# EAGLE schematic MainBoard (EAGLE 7.2.0)
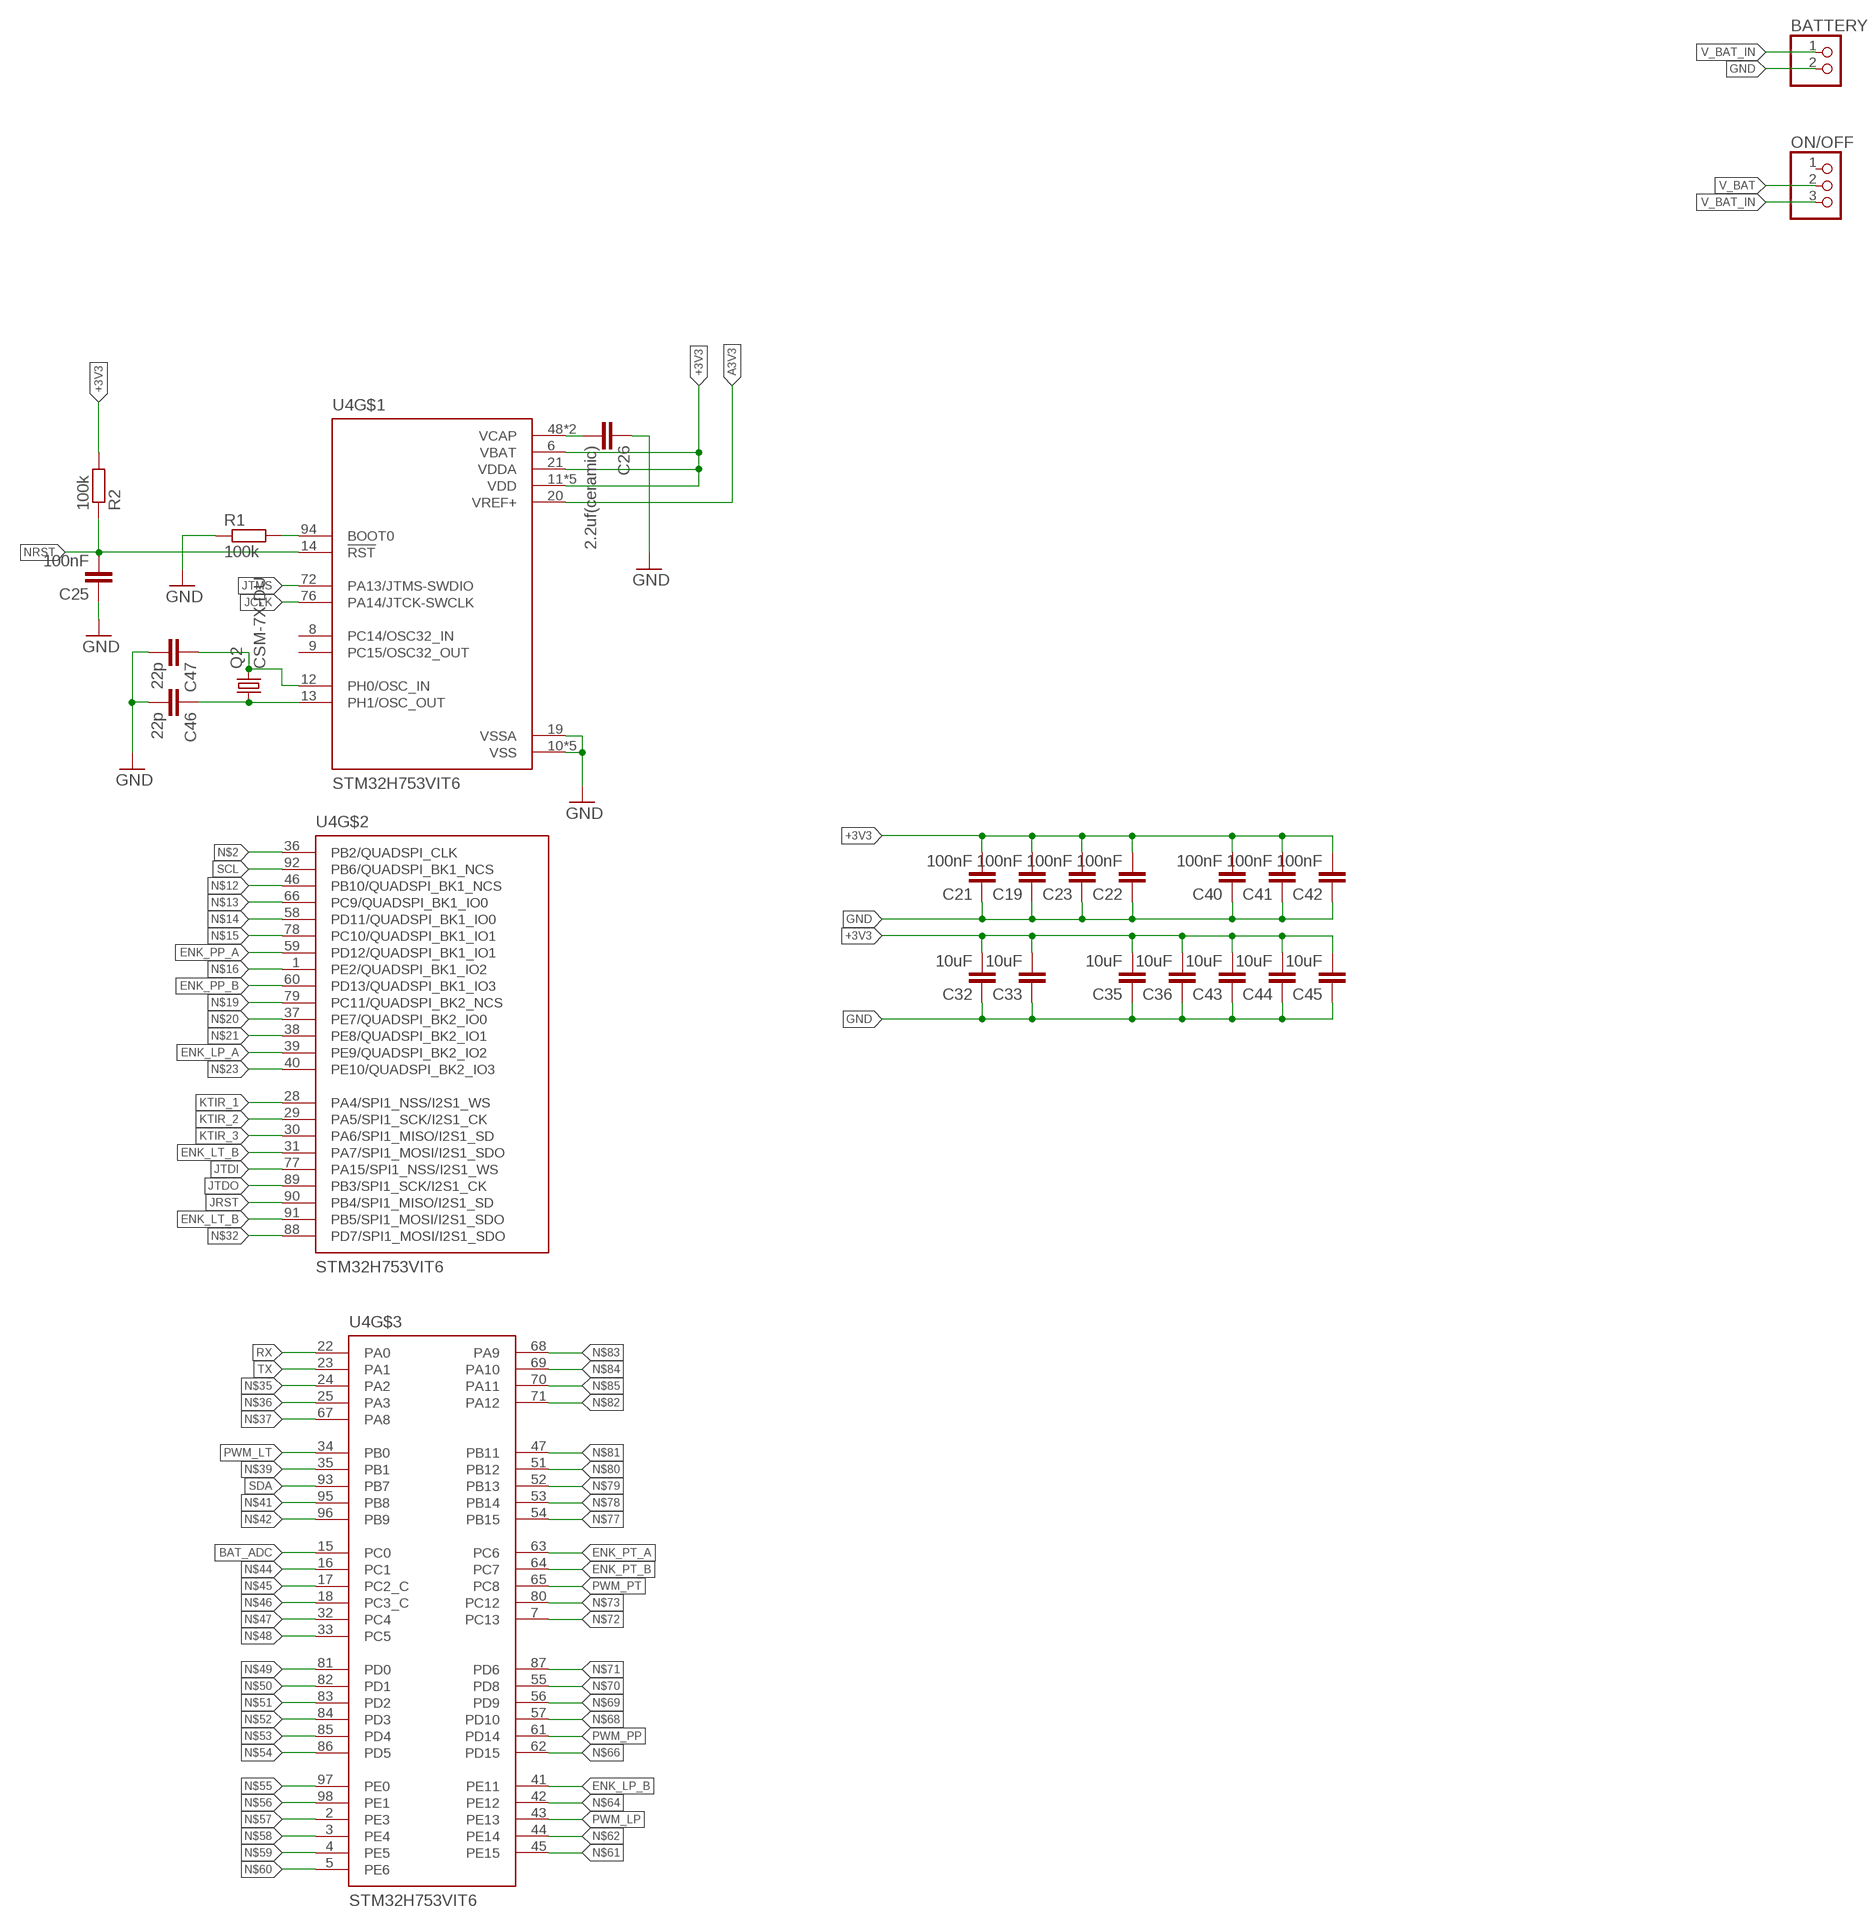
[diagram p0: schematic, sheet 1, part 1 of 2]
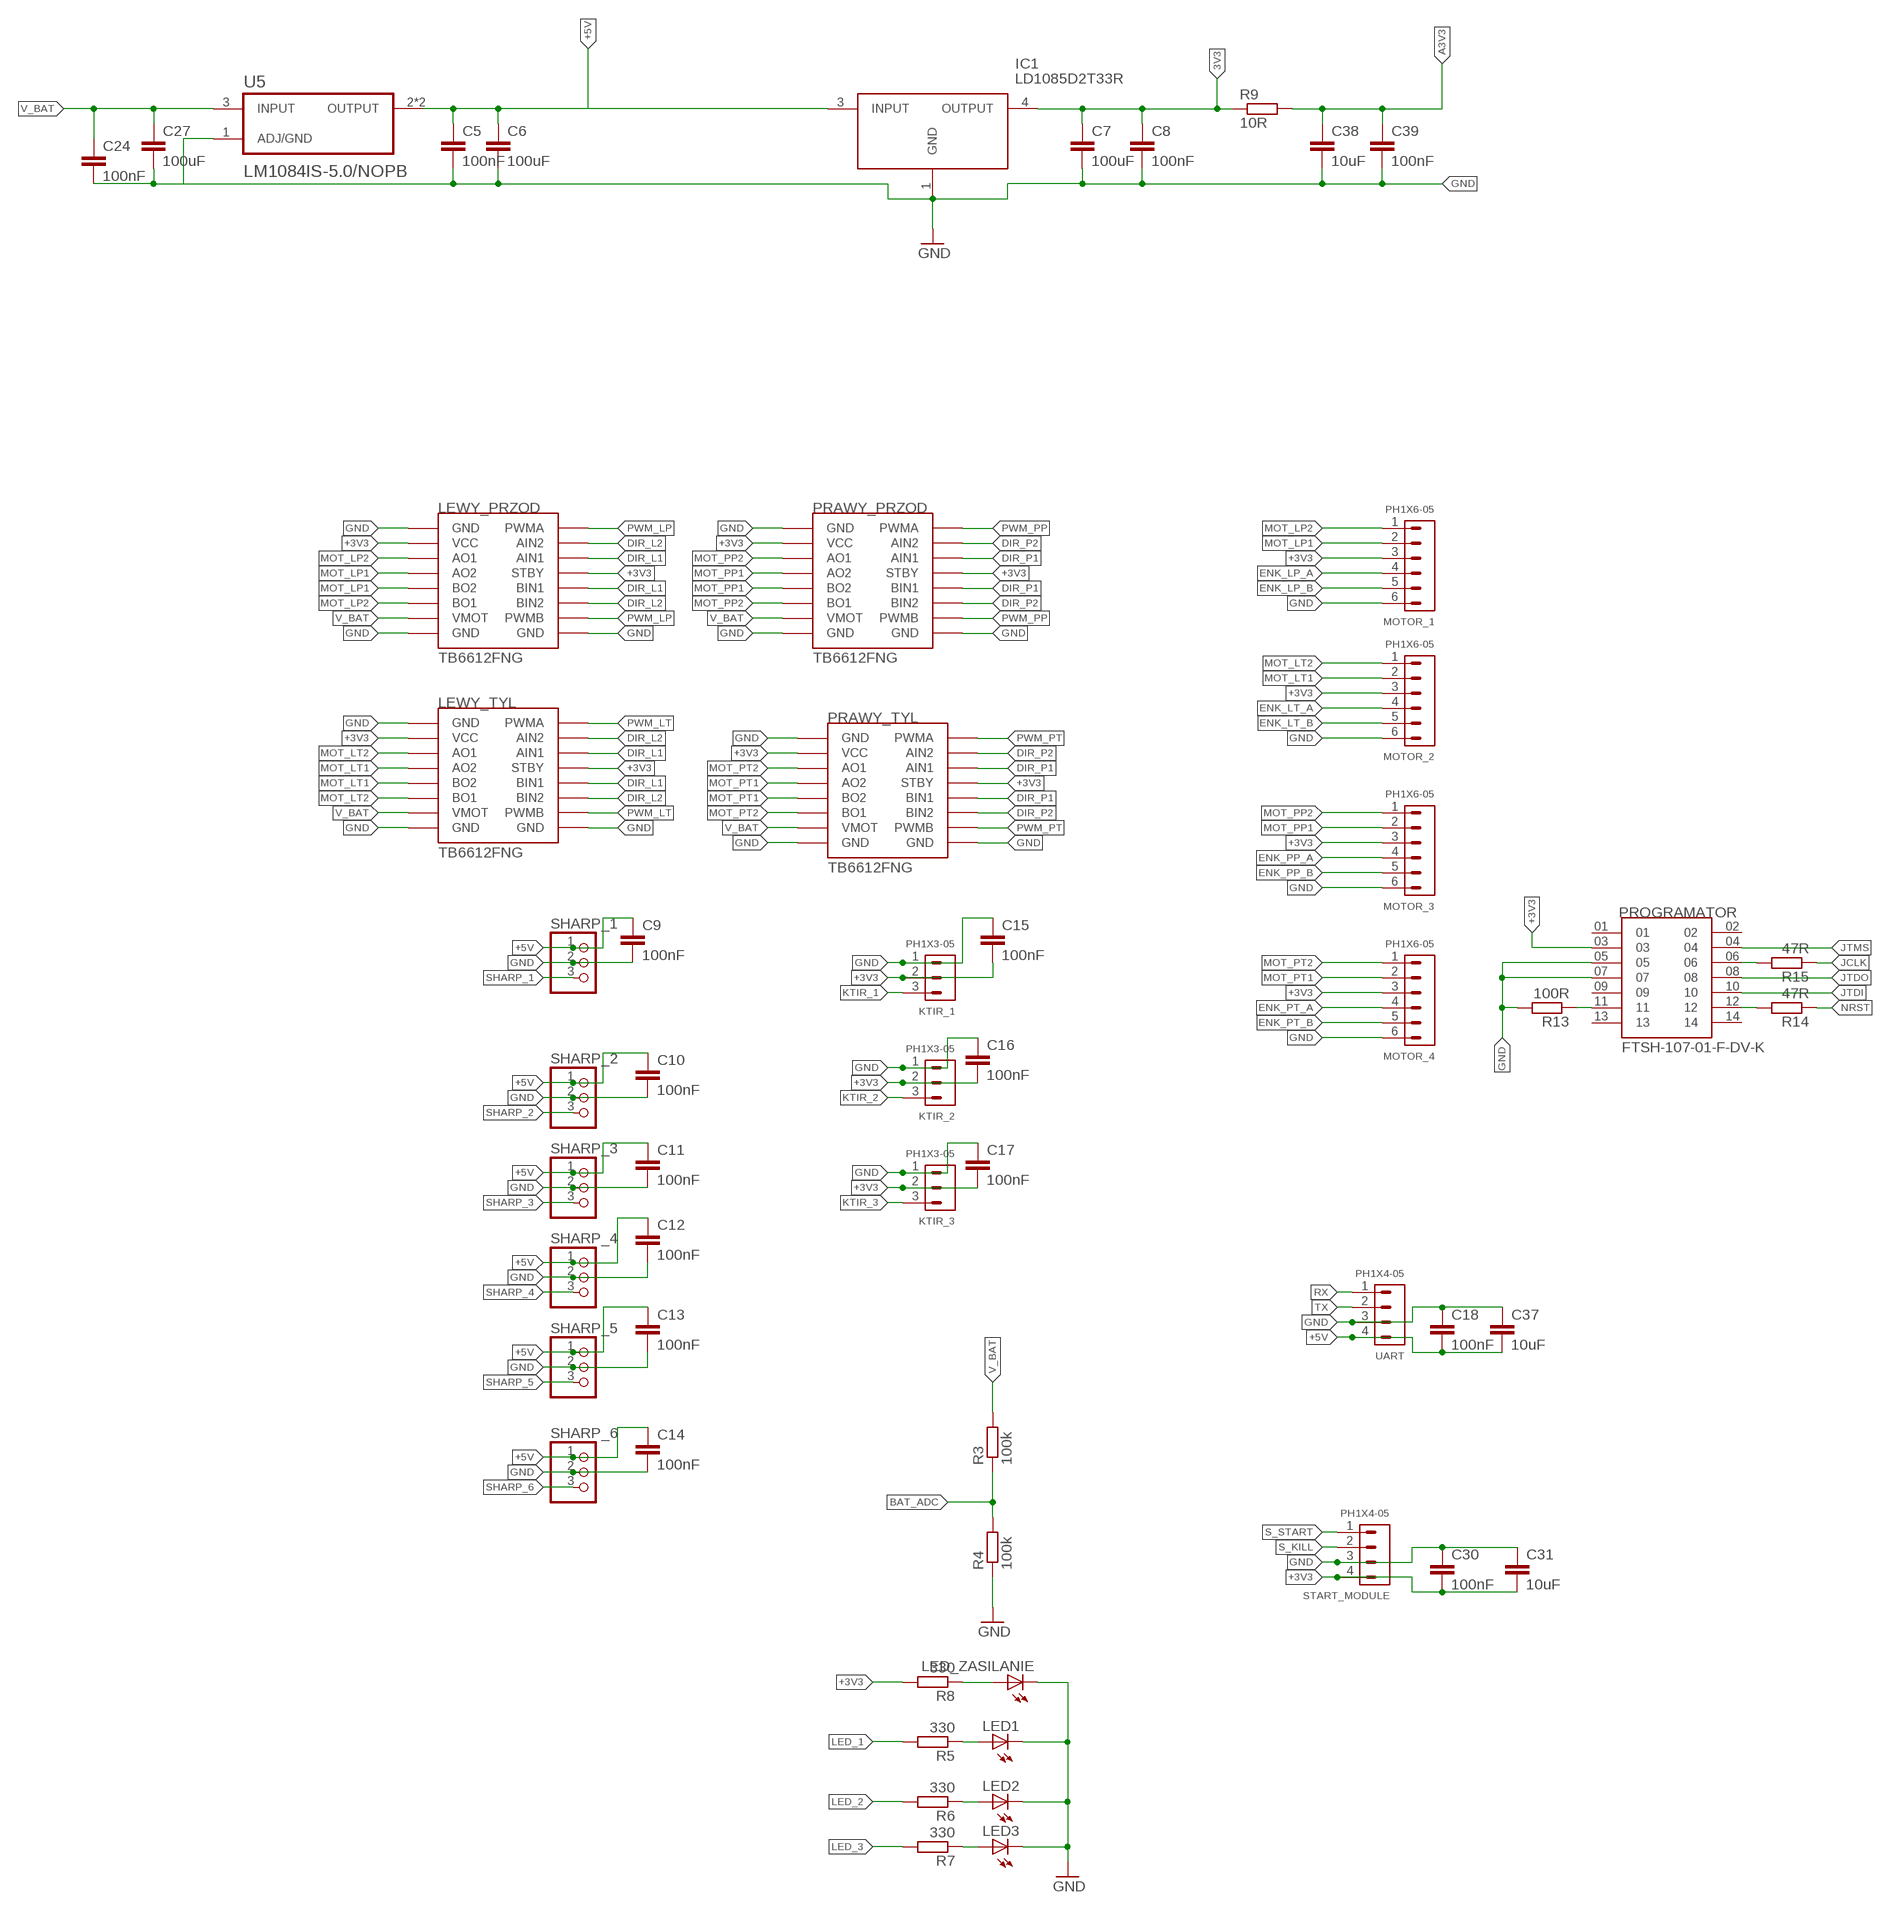
[diagram p1: schematic, sheet 1, part 2 of 2]

## Parts
BATTERY  PINHD-1X2  [1X02]
C5  100nF  C-EUC0805  [C0805]
C6  100uF  C-EUC0805  [C0805]
C7  100uF  C-EUC0805  [C0805]
C8  100nF  C-EUC0805  [C0805]
C9  100nF  C-EUC0805  [C0805]
C10  100nF  C-EUC0805  [C0805]
C11  100nF  C-EUC0805  [C0805]
C12  100nF  C-EUC0805  [C0805]
C13  100nF  C-EUC0805  [C0805]
C14  100nF  C-EUC0805  [C0805]
C15  100nF  C-EUC0805  [C0805]
C16  100nF  C-EUC0805  [C0805]
C17  100nF  C-EUC0805  [C0805]
C18  100nF  C-EUC0805  [C0805]
C19  100nF  C-EUC0805  [C0805]
C21  100nF  C-EUC0805  [C0805]
C22  100nF  C-EUC0805  [C0805]
C23  100nF  C-EUC0805  [C0805]
C24  100nF  C-EUC0805  [C0805]
C25  100nF  C-EUC0805  [C0805]
C26  2.2uf(ceramic)  C-EUC0805  [C0805]
C27  100uF  C-EUC0805  [C0805]
C30  100nF  C-EUC0805  [C0805]
C31  10uF  C-EUC0805  [C0805]
C32  10uF  C-EUC0805  [C0805]
C33  10uF  C-EUC0805  [C0805]
C35  10uF  C-EUC0805  [C0805]
C36  10uF  C-EUC0805  [C0805]
C37  10uF  C-EUC0805  [C0805]
C38  10uF  C-EUC0805  [C0805]
C39  100nF  C-EUC0805  [C0805]
C40  100nF  C-EUC0805  [C0805]
C41  100nF  C-EUC0805  [C0805]
C42  100nF  C-EUC0805  [C0805]
C43  10uF  C-EUC0805  [C0805]
C44  10uF  C-EUC0805  [C0805]
C45  10uF  C-EUC0805  [C0805]
C46  22p  C-EUC0805  [C0805]
C47  22p  C-EUC0805  [C0805]
IC1  LD1085D2T33R  [LD1085D2T33R]
KTIR_1  PH1X3-05  [PH005-1-3]
KTIR_2  PH1X3-05  [PH005-1-3]
KTIR_3  PH1X3-05  [PH005-1-3]
LED1  LEDCHIPLED_0805  [CHIPLED_0805]
LED2  LEDCHIPLED_0805  [CHIPLED_0805]
LED3  LEDCHIPLED_0805  [CHIPLED_0805]
LED_ZASILANIE  LEDCHIPLED_0805  [CHIPLED_0805]
LEWY_PRZOD  MODUL_POLOLU  [MODUL_POLOLU]
LEWY_TYL  MODUL_POLOLU  [MODUL_POLOLU]
MOTOR_1  PH1X6-05  [PH005-1-6]
MOTOR_2  PH1X6-05  [PH005-1-6]
MOTOR_3  PH1X6-05  [PH005-1-6]
MOTOR_4  PH1X6-05  [PH005-1-6]
ON/OFF  PINHD-1X3  [1X03]
PRAWY_PRZOD  MODUL_POLOLU  [MODUL_POLOLU]
PRAWY_TYL  MODUL_POLOLU  [MODUL_POLOLU]
PROGRAMATOR  FTSH-107-01-F-DV-K  [SAMTEC_FTSH-107-01-F-DV-K]
Q2  CSM-7X-DU  [CSM-7X-DU]
R1  100k  R-EU_M0805  [M0805]
R2  100k  R-EU_M0805  [M0805]
R3  100k  R-EU_M0805  [M0805]
R4  100k  R-EU_M0805  [M0805]
R5  330  R-EU_M0805  [M0805]
R6  330  R-EU_M0805  [M0805]
R7  330  R-EU_M0805  [M0805]
R8  330  R-EU_M0805  [M0805]
R9  10R  R-EU_M0805  [M0805]
R13  100R  R-EU_M0805  [M0805]
R14  47R  R-EU_M0805  [M0805]
R15  47R  R-EU_M0805  [M0805]
SHARP_1  PINHD-1X3  [1X03]
SHARP_2  PINHD-1X3  [1X03]
SHARP_3  PINHD-1X3  [1X03]
SHARP_4  PINHD-1X3  [1X03]
SHARP_5  PINHD-1X3  [1X03]
SHARP_6  PINHD-1X3  [1X03]
START_MODULE  PH1X4-05  [PH005-1-4]
U4  STM32H753VIT6  [QFP50P1600X1600X160-100N]
U5  LM1084IS-5.0/NOPB  [TO254P1524X483-4N]
UART  PH1X4-05  [PH005-1-4]

## Nets
3V3: C7.1 C8.1 IC1.4(OUTPUT) R9.1
+3V3: C15.2 C16.2 C17.2 C19.2 C21.2 C22.2 C23.2 C30.2 C31.2 C32.2 C33.2 C35.2 C36.2 C40.2 C41.2 C42.2 C43.2 C44.2 C45.2 KTIR_1.2 KTIR_2.2 KTIR_3.2 LEWY_PRZOD.STBY LEWY_PRZOD.VCC LEWY_TYL.STBY LEWY_TYL.VCC MOTOR_1.3 MOTOR_2.3 MOTOR_3.3 MOTOR_4.3 PRAWY_PRZOD.STBY PRAWY_PRZOD.VCC PRAWY_TYL.STBY PRAWY_TYL.VCC PROGRAMATOR.03 R2.2 R8.2 START_MODULE.4 U4.6(VBAT) U4.11(VDD) U4.21(VDDA) U4.27(VDD) U4.50(VDD) U4.75(VDD) U4.100(VDD)
+5V: C5.1 C6.1 C9.1 C10.1 C11.1 C12.1 C13.1 C14.1 C18.2 C37.2 IC1.3(INPUT) SHARP_1.1 SHARP_2.1 SHARP_3.1 SHARP_4.1 SHARP_5.1 SHARP_6.1 U5.2(OUTPUT) U5.4(OUTPUT) UART.4
A3V3: C38.1 C39.1 R9.2 U4.20(VREF+)
BAT_ADC: R3.1 R4.2 U4.15(PC0)
DIR_L1: LEWY_PRZOD.AIN1 LEWY_PRZOD.BIN1 LEWY_TYL.AIN1 LEWY_TYL.BIN1
DIR_L2: LEWY_PRZOD.AIN2 LEWY_PRZOD.BIN2 LEWY_TYL.AIN2 LEWY_TYL.BIN2
DIR_P1: PRAWY_PRZOD.AIN1 PRAWY_PRZOD.BIN1 PRAWY_TYL.AIN1 PRAWY_TYL.BIN1
DIR_P2: PRAWY_PRZOD.AIN2 PRAWY_PRZOD.BIN2 PRAWY_TYL.AIN2 PRAWY_TYL.BIN2
ENK_LP_A: MOTOR_1.4 U4.39(PE9/QUADSPI_BK2_IO2)
ENK_LP_B: MOTOR_1.5 U4.41(PE11)
ENK_LT_A: MOTOR_2.4
ENK_LT_B: MOTOR_2.5 U4.31(PA7/SPI1_MOSI/I2S1_SDO) U4.91(PB5/SPI1_MOSI/I2S1_SDO)
ENK_PP_A: MOTOR_3.4 U4.59(PD12/QUADSPI_BK1_IO1)
ENK_PP_B: MOTOR_3.5 U4.60(PD13/QUADSPI_BK1_IO3)
ENK_PT_A: MOTOR_4.4 U4.63(PC6)
ENK_PT_B: MOTOR_4.5 U4.64(PC7)
GND: BATTERY.2 C5.2 C6.2 C7.2 C8.2 C9.2 C10.2 C11.2 C12.2 C13.2 C14.2 C15.1 C16.1 C17.1 C18.1 C19.1 C21.1 C22.1 C23.1 C25.1 C26.1 C30.1 C31.1 C32.1 C33.1 C35.1 C36.1 C37.1 C38.2 C39.2 C40.1 C41.1 C42.1 C43.1 C44.1 C45.1 C46.2 C47.2 IC1.1(GND) KTIR_1.1 KTIR_2.1 KTIR_3.1 LED1.C LED2.C LED3.C LED_ZASILANIE.C LEWY_PRZOD.GND1(GND) LEWY_PRZOD.GND2(GND) LEWY_PRZOD.GND3(GND) LEWY_TYL.GND1(GND) LEWY_TYL.GND2(GND) LEWY_TYL.GND3(GND) MOTOR_1.6 MOTOR_2.6 MOTOR_3.6 MOTOR_4.6 PRAWY_PRZOD.GND1(GND) PRAWY_PRZOD.GND2(GND) PRAWY_PRZOD.GND3(GND) PRAWY_TYL.GND1(GND) PRAWY_TYL.GND2(GND) PRAWY_TYL.GND3(GND) PROGRAMATOR.05 PROGRAMATOR.07 R1.1 R4.1 R13.2 SHARP_1.2 SHARP_2.2 SHARP_3.2 SHARP_4.2 SHARP_5.2 SHARP_6.2 START_MODULE.3 U4.10(VSS) U4.19(VSSA) U4.26(VSS) U4.49(VSS) U4.74(VSS) U4.99(VSS) UART.3
JCLK: R15.1 U4.76(PA14/JTCK-SWCLK)
JRST: U4.90(PB4/SPI1_MISO/I2S1_SD)
JTDI: PROGRAMATOR.10 U4.77(PA15/SPI1_NSS/I2S1_WS)
JTDO: PROGRAMATOR.08 U4.89(PB3/SPI1_SCK/I2S1_CK)
JTMS: PROGRAMATOR.04 U4.72(PA13/JTMS-SWDIO)
KTIR_1: KTIR_1.3 U4.28(PA4/SPI1_NSS/I2S1_WS)
KTIR_2: KTIR_2.3 U4.29(PA5/SPI1_SCK/I2S1_CK)
KTIR_3: KTIR_3.3 U4.30(PA6/SPI1_MISO/I2S1_SD)
LED_1: R5.2
LED_2: R6.2
LED_3: R7.2
MOT_LP1: LEWY_PRZOD.A02(AO2) LEWY_PRZOD.BO2 MOTOR_1.2
MOT_LP2: LEWY_PRZOD.AO1 LEWY_PRZOD.BO1 MOTOR_1.1
MOT_LT1: LEWY_TYL.A02(AO2) LEWY_TYL.BO2 MOTOR_2.2
MOT_LT2: LEWY_TYL.AO1 LEWY_TYL.BO1 MOTOR_2.1
MOT_PP1: MOTOR_3.2 PRAWY_PRZOD.A02(AO2) PRAWY_PRZOD.BO2
MOT_PP2: MOTOR_3.1 PRAWY_PRZOD.AO1 PRAWY_PRZOD.BO1
MOT_PT1: MOTOR_4.2 PRAWY_TYL.A02(AO2) PRAWY_TYL.BO2
MOT_PT2: MOTOR_4.1 PRAWY_TYL.AO1 PRAWY_TYL.BO1
N$1: PROGRAMATOR.11 R13.1
N$2: U4.36(PB2/QUADSPI_CLK)
N$3: R1.2 U4.94(BOOT0)
N$4: C26.2 U4.48(VCAP) U4.73(VCAP)
N$5: LED1.A R5.1
N$6: LED2.A R6.1
N$7: LED3.A R7.1
N$8: PROGRAMATOR.12 R14.2
N$9: LED_ZASILANIE.A R8.1
N$10: C47.1 Q2.2 U4.12(PH0/OSC_IN)
N$11: C46.1 Q2.1 U4.13(PH1/OSC_OUT)
N$12: U4.46(PB10/QUADSPI_BK1_NCS)
N$13: U4.66(PC9/QUADSPI_BK1_IO0)
N$14: U4.58(PD11/QUADSPI_BK1_IO0)
N$15: U4.78(PC10/QUADSPI_BK1_IO1)
N$16: U4.1(PE2/QUADSPI_BK1_IO2)
N$17: PROGRAMATOR.06 R15.2
N$19: U4.79(PC11/QUADSPI_BK2_NCS)
N$20: U4.37(PE7/QUADSPI_BK2_IO0)
N$21: U4.38(PE8/QUADSPI_BK2_IO1)
N$23: U4.40(PE10/QUADSPI_BK2_IO3)
N$32: U4.88(PD7/SPI1_MOSI/I2S1_SDO)
N$35: U4.24(PA2)
N$36: U4.25(PA3)
N$37: U4.67(PA8)
N$39: U4.35(PB1)
N$41: U4.95(PB8)
N$42: U4.96(PB9)
N$44: U4.16(PC1)
N$45: U4.17(PC2_C)
N$46: U4.18(PC3_C)
N$47: U4.32(PC4)
N$48: U4.33(PC5)
N$49: U4.81(PD0)
N$50: U4.82(PD1)
N$51: U4.83(PD2)
N$52: U4.84(PD3)
N$53: U4.85(PD4)
N$54: U4.86(PD5)
N$55: U4.97(PE0)
N$56: U4.98(PE1)
N$57: U4.2(PE3)
N$58: U4.3(PE4)
N$59: U4.4(PE5)
N$60: U4.5(PE6)
N$61: U4.45(PE15)
N$62: U4.44(PE14)
N$64: U4.42(PE12)
N$66: U4.62(PD15)
N$68: U4.57(PD10)
N$69: U4.56(PD9)
N$70: U4.55(PD8)
N$71: U4.87(PD6)
N$72: U4.7(PC13)
N$73: U4.80(PC12)
N$77: U4.54(PB15)
N$78: U4.53(PB14)
N$79: U4.52(PB13)
N$80: U4.51(PB12)
N$81: U4.47(PB11)
N$82: U4.71(PA12)
N$83: U4.68(PA9)
N$84: U4.69(PA10)
N$85: U4.70(PA11)
N$88: C24.2 C27.2 U5.1(ADJ/GND)
NRST: C25.2 R2.1 R14.1 U4.14(!RST)
PWM_LP: LEWY_PRZOD.PWMA LEWY_PRZOD.PWMB U4.43(PE13)
PWM_LT: LEWY_TYL.PWMA LEWY_TYL.PWMB U4.34(PB0)
PWM_PP: PRAWY_PRZOD.PWMA PRAWY_PRZOD.PWMB U4.61(PD14)
PWM_PT: PRAWY_TYL.PWMA PRAWY_TYL.PWMB U4.65(PC8)
RX: U4.22(PA0) UART.1
S_KILL: START_MODULE.2
S_START: START_MODULE.1
SCL: U4.92(PB6/QUADSPI_BK1_NCS)
SDA: U4.93(PB7)
SHARP_1: SHARP_1.3
SHARP_2: SHARP_2.3
SHARP_3: SHARP_3.3
SHARP_4: SHARP_4.3
SHARP_5: SHARP_5.3
SHARP_6: SHARP_6.3
TX: U4.23(PA1) UART.2
V_BAT: C24.1 C27.1 LEWY_PRZOD.VMOT LEWY_TYL.VMOT ON/OFF.2 PRAWY_PRZOD.VMOT PRAWY_TYL.VMOT R3.2 U5.3(INPUT)
V_BAT_IN: BATTERY.1 ON/OFF.3
Unconnected: ON/OFF.1 PROGRAMATOR.01 PROGRAMATOR.02 PROGRAMATOR.09 PROGRAMATOR.13 PROGRAMATOR.14 U4.8(PC14/OSC32_IN) U4.9(PC15/OSC32_OUT)

## Library data of the parts
BATTERY = pinhead:PINHD-1X2: PIN HEADER
C5-C19 C21-C27 C30-C33 C35-C47 = rcl:C-EU: CAPACITOR, European symbol
IC1 = SamacSys_Parts:LD1085D2T33R: LD1085D2T33R, Low Dropout Voltage Regulator, 3A, 3.3 V +/-1%, 3-Pin D2PAK Source: Datasheet <http://www.st.com/web/en/resource/technical/document/datasheet/CD00001883.pdf>; DESCRIPTION: LD1085D2T33R, Low Dropout Voltage Regulator, 3A, 3.3 V +/-1%, 3-Pin D2PAK; HEIGHT: mm; MANUFACTURER_NAME: STMicroelectronics; MANUFACTURER_PART_NUMBER: LD1085D2T33R; MOUSER_PART_NUMBER: 511-LD1085D2T33-TR; MOUSER_PRICE-STOCK: https://www.mouser.co.uk/ProductDetail/STMicroelectronics/LD1085D2T33R?qs=%252BlpsHQzXjw%252B%2FdNCHtZO2HA%3D%3D
KTIR_1-KTIR_3 = pinhrad:PH1X3
LED1-LED3 LED_ZASILANIE = led:LED: LED OSRAM: - CHIPLED LG R971, LG N971, LY N971, LG Q971, LY Q971, LO R971, LY R971 LH N974, LH R974 LS Q976, LO Q976, LY Q976 LO Q996 - Hyper CHIPLED LW Q18S LB Q993, LB Q99A, LB R99A - SideLED LS A670, LO A670, LY A670, LG A670, LP A670 LB A673, LV A673, LT A673, LW A673 LH A674 LY A675 LS A676, LA A676, LO A676, LY A676, LW A676 LS A679, LY A679, LG A679 - Hyper Micro SIDELED® LS Y876, LA Y876, LO Y876, LY Y876 LT Y87S - SmartLED LW L88C, LW L88S LB L89C, LB L89S, LG L890 LS L89K, LO L89K, LY L89K LS L896, LA L896, LO L896, LY L896 - TOPLED LS T670, LO T670, LY T670, LG T670, LP T670 LSG T670, LSP T670, LSY T670, LOP T670, LYG T670 LG T671, LOG T671, LSG T671 LB T673, LV T673, LT T673, LW T673 LH T674 LS T676, LA T676, LO T676, LY T676, LB T676, LH T676, LSB T676, LW T676 LB T67C, LV T67C, LT T67C, LS T67K, LO T67K, LY T67K, LW E67C LS E67B, LA E67B, LO E67B, LY E67B, LB E67C, LV E67C, LT E67C LW T67C LS T679, LY T679, LG T679 LS T770, LO T770, LY T770, LG T770, LP T770 LB T773, LV T773, LT T773, LW T773 LH T774 LS E675, LA E675, LY E675, LS T675 LS T776, LA T776, LO T776, LY T776, LB T776 LHGB T686 LT T68C, LB T68C - Hyper Mini TOPLED® LB M676 - Mini TOPLED Santana® LG M470 LS M47K, LO M47K, LY M47K Source: http://www.osram.convergy.de LUXEON: - LUMILED® LXK2-PW12-R00, LXK2-PW12-S00, LXK2-PW14-U00, LXK2-PW14-V00 LXK2-PM12-R00, LXK2-PM12-S00, LXK2-PM14-U00 LXK2-PE12-Q00, LXK2-PE12-R00, LXK2-PE12-S00, LXK2-PE14-T00, LXK2-PE14-U00 LXK2-PB12-K00, LXK2-PB12-L00, LXK2-PB12-M00, LXK2-PB14-N00, LXK2-PB14-P00, LXK2-PB14-Q00 LXK2-PR12-L00, LXK2-PR12-M00, LXK2-PR14-Q00, LXK2-PR14-R00 LXK2-PD12-Q00, LXK2-PD12-R00, LXK2-PD12-S00 LXK2-PH12-R00, LXK2-PH12-S00 LXK2-PL12-P00, LXK2-PL12-Q00, LXK2-PL12-R00 Source: www.luxeon.com KINGBRIGHT: KA-3528ASYC Source: www.kingbright.com
LEWY_PRZOD LEWY_TYL PRAWY_PRZOD PRAWY_TYL = TB6612FNG:MODUL_POLOLU
MOTOR_1-MOTOR_4 = pinhrad:PH1X6
ON/OFF SHARP_1-SHARP_6 = pinhead:PINHD-1X3: PIN HEADER
PROGRAMATOR = FTSH-107-01-F-DV-K:FTSH-107-01-F-DV-K: Check availability <https://pricing.snapeda.com/parts/FTSH-107-01-F-DV-K/Samtec/view-part?ref=eda>; AVAILABILITY: In Stock; DESCRIPTION: Connector Header Surface Mount 14 position 0.050 (1.27mm); MF: Samtec; MP: FTSH-107-01-F-DV-K; PACKAGE: None; PRICE: None; PURCHASE-URL: https://pricing.snapeda.com/search/part/FTSH-107-01-F-DV-K/?ref=eda
Q2 = crystal:CSM-7X-DU: SMD CRYSTAL Source: www.ecsxtal.com .. Crystal 3.6864MHz CSM_7X_DU.PDF; OC_FARNELL: unknown; OC_NEWARK: unknown
R1-R9 R13-R15 = rcl:R-EU_: RESISTOR, European symbol
START_MODULE UART = pinhrad:PH1X4
U4 = STM32H753VIT6:STM32H753VIT6: ARM® Cortex®-M7 STM32H7 Microcontroller IC 32-Bit 480MHz 2MB (2M x 8) FLASH 100-LQFP (14x14) Check availability <https://pricing.snapeda.com/parts/STM32H753VIT6/STMicroelectronics/view-part?ref=eda>; AVAILABILITY: In Stock; DESCRIPTION: ARM® Cortex®-M7 series Microcontroller IC 32-Bit Single-Core 480MHz 2MB (2M x 8) FLASH 100-LQFP (14x14); MF: STMicroelectronics; MP: STM32H753VIT6; PACKAGE: LQFP-100 STMicroelectronics; PRICE: None; PURCHASE-URL: https://pricing.snapeda.com/search/part/STM32H753VIT6/?ref=eda
U5 = LM1084IS-5.0_NOPB:LM1084IS-5.0/NOPB: Check availability <https://pricing.snapeda.com/parts/LM1084IS-5.0/NOPB/Texas%20Instruments/view-part?ref=eda>; AVAILABILITY: In Stock; DESCRIPTION: 5.5-A, 29-V, linear voltage regulator; MF: Texas Instruments; MP: LM1084IS-5.0/NOPB; PACKAGE: TO-263-3 Texas Instruments; PRICE: None; PURCHASE-URL: https://pricing.snapeda.com/search/part/LM1084IS-5.0/NOPB/?ref=eda